# Altium schematic sheet MainPorts.SchDoc
size A4; SheetNumber: 1; SheetTotal: 7
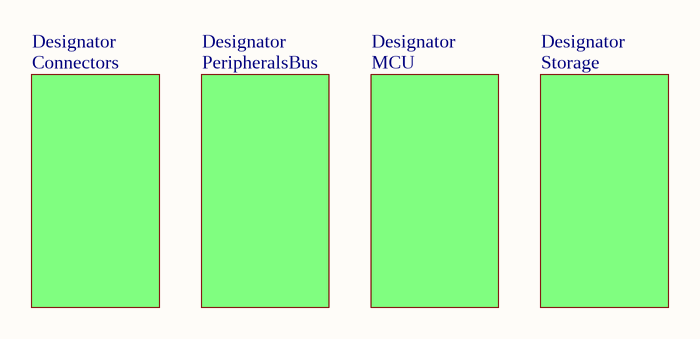
[diagram p0: MainPorts.SchDoc]

## Sub-sheets
Designator = MCU: no entries
Designator = Storage: no entries
Designator = Connectors: no entries
Designator = PeripheralsBus: no entries